# EasyEDA Pro project ProPrj_WatcheRobot2.0openSource_2026-06-17.epro, schematic 无线充电底座PCB
Assembly Variant: Basic; Board Name: Board1; Create Date: 2026-04-29; Page Name: P1; Project Name: WatcheRobot2.0; Schematic Name: Schematic4; Update Date: 2026-04-29; Company: 嘉立创EDA; Page Size: A4; Version: V1.0
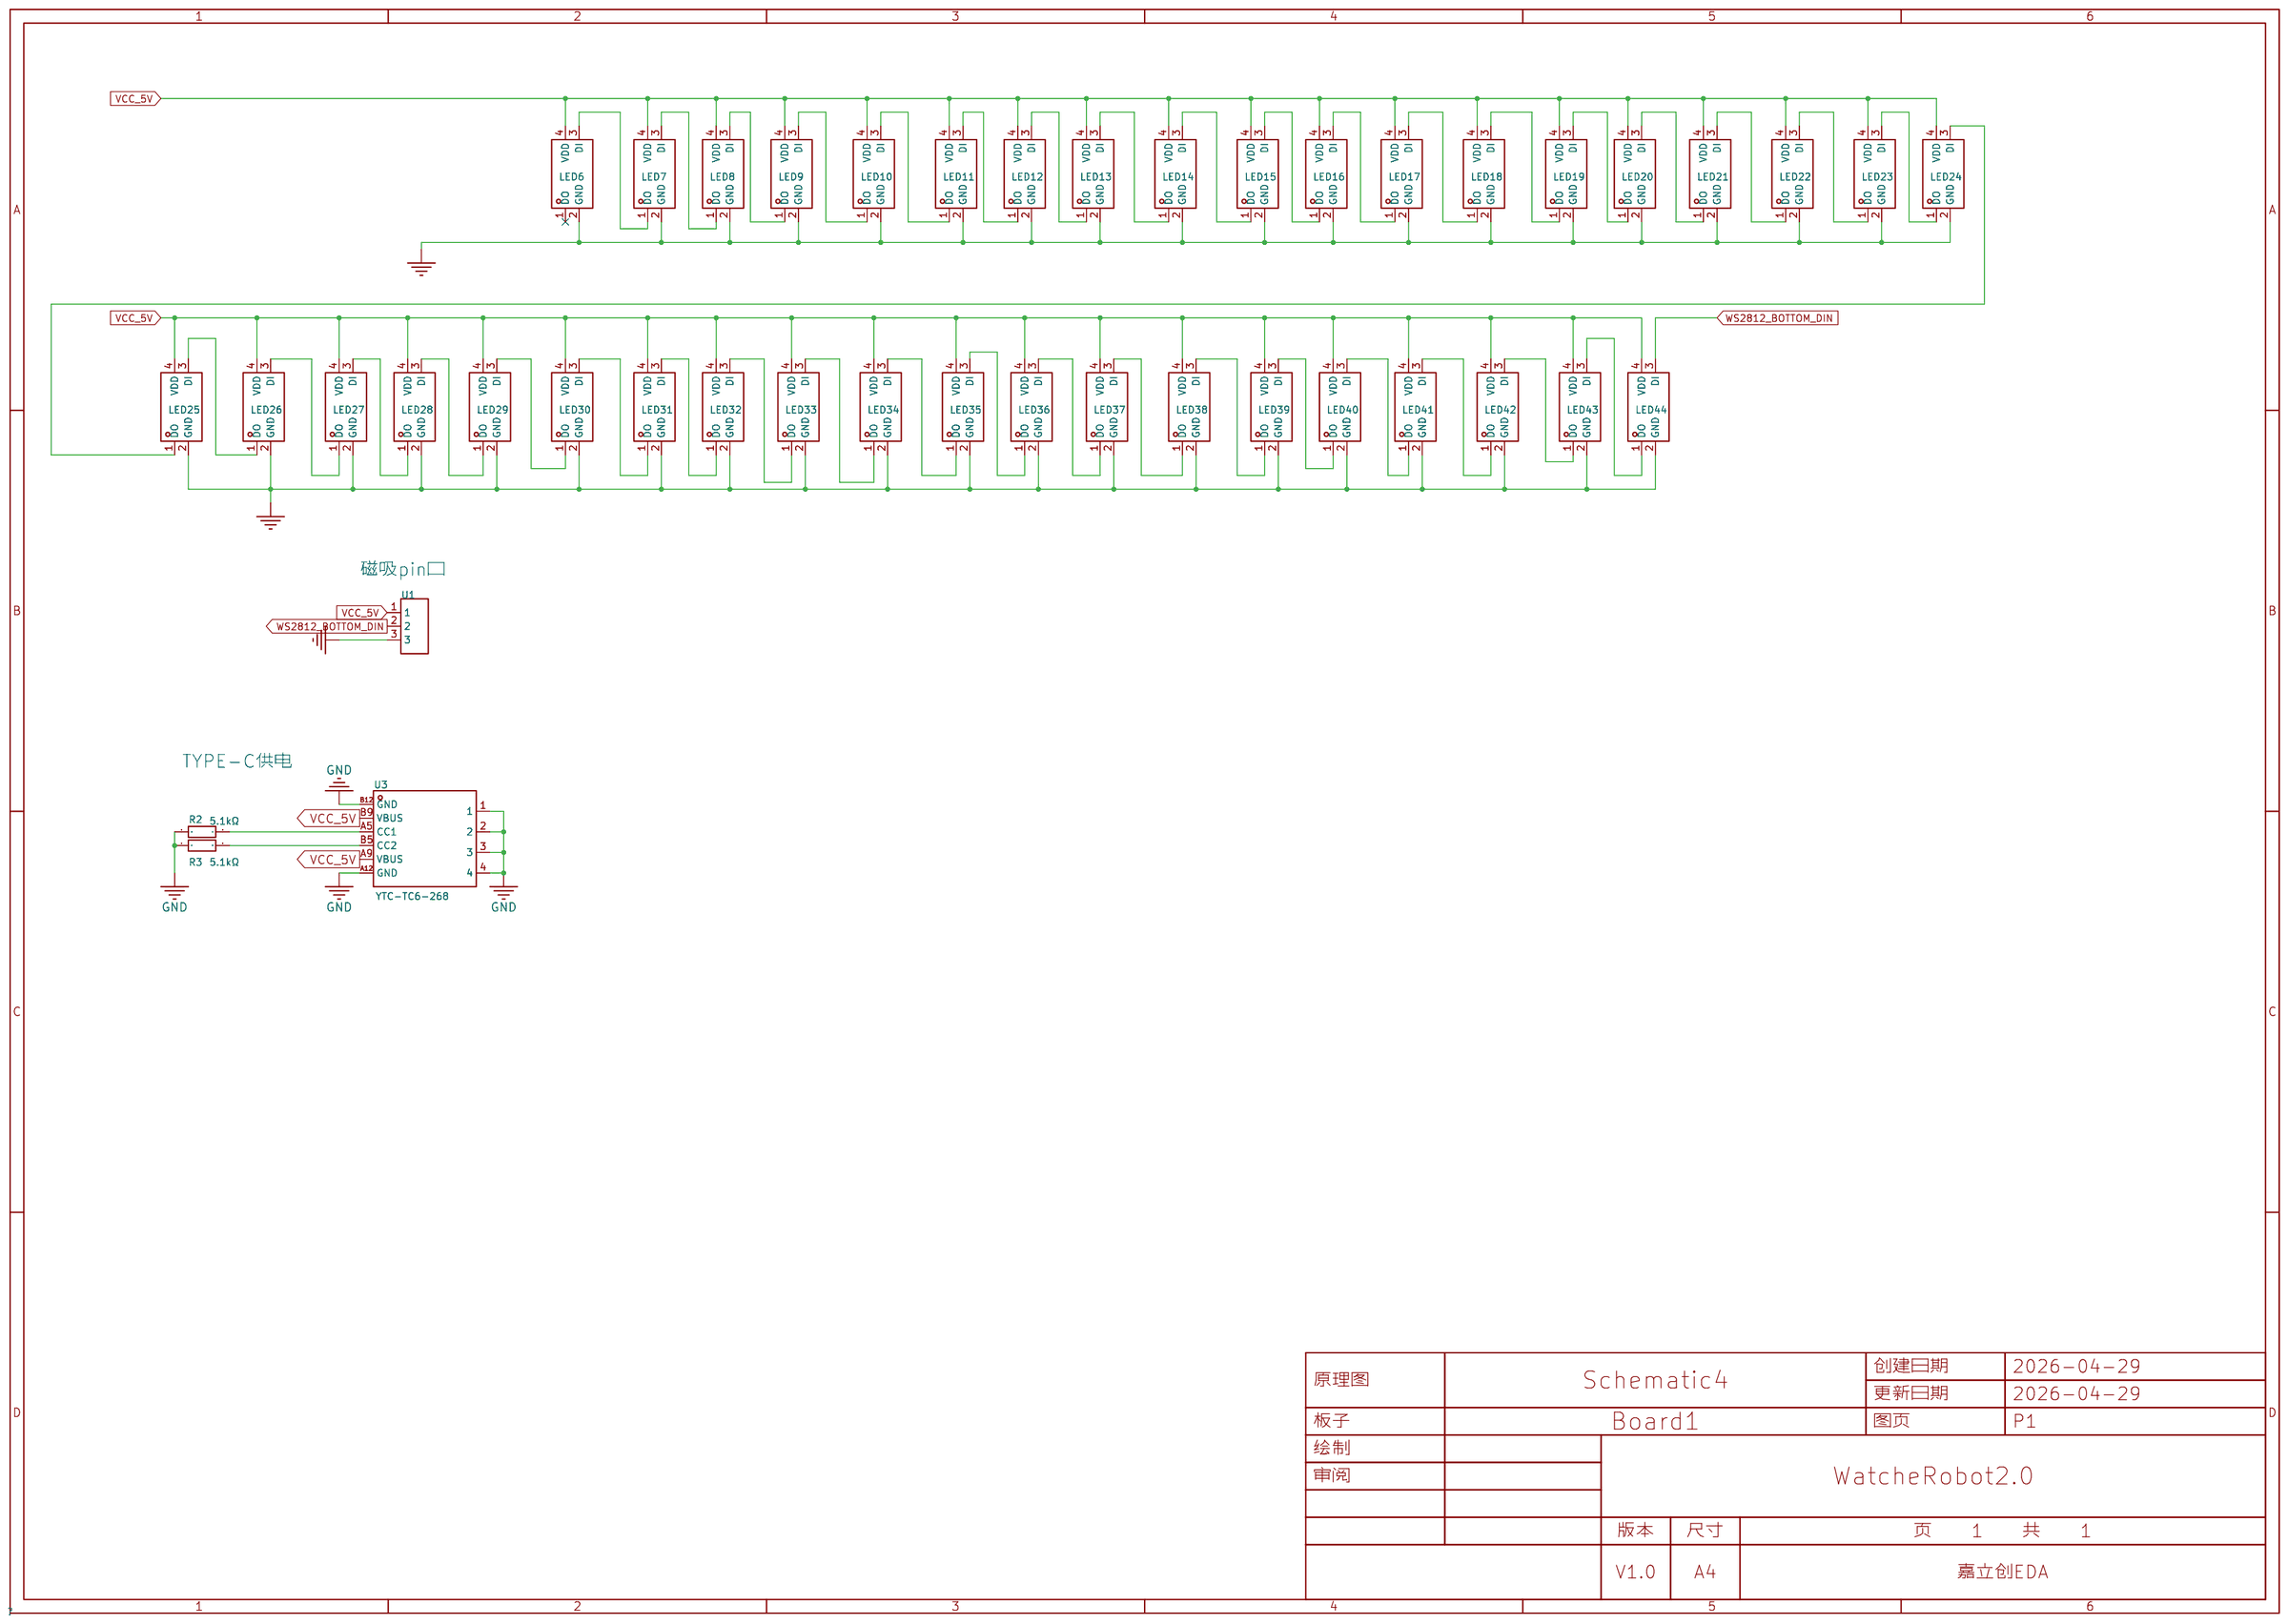
[diagram p1: schematic sheet]

## Parts
LED6  WS2812B-2020  [LED-SMD_4P-L2.0-W2.0-TL_WS2812B-2020]
LED7  WS2812B-2020  [LED-SMD_4P-L2.0-W2.0-TL_WS2812B-2020]
LED8  WS2812B-2020  [LED-SMD_4P-L2.0-W2.0-TL_WS2812B-2020]
LED9  WS2812B-2020  [LED-SMD_4P-L2.0-W2.0-TL_WS2812B-2020]
LED10  WS2812B-2020  [LED-SMD_4P-L2.0-W2.0-TL_WS2812B-2020]
LED11  WS2812B-2020  [LED-SMD_4P-L2.0-W2.0-TL_WS2812B-2020]
LED12  WS2812B-2020  [LED-SMD_4P-L2.0-W2.0-TL_WS2812B-2020]
LED13  WS2812B-2020  [LED-SMD_4P-L2.0-W2.0-TL_WS2812B-2020]
LED14  WS2812B-2020  [LED-SMD_4P-L2.0-W2.0-TL_WS2812B-2020]
LED15  WS2812B-2020  [LED-SMD_4P-L2.0-W2.0-TL_WS2812B-2020]
LED16  WS2812B-2020  [LED-SMD_4P-L2.0-W2.0-TL_WS2812B-2020]
LED17  WS2812B-2020  [LED-SMD_4P-L2.0-W2.0-TL_WS2812B-2020]
LED18  WS2812B-2020  [LED-SMD_4P-L2.0-W2.0-TL_WS2812B-2020]
LED19  WS2812B-2020  [LED-SMD_4P-L2.0-W2.0-TL_WS2812B-2020]
LED20  WS2812B-2020  [LED-SMD_4P-L2.0-W2.0-TL_WS2812B-2020]
LED21  WS2812B-2020  [LED-SMD_4P-L2.0-W2.0-TL_WS2812B-2020]
LED22  WS2812B-2020  [LED-SMD_4P-L2.0-W2.0-TL_WS2812B-2020]
LED23  WS2812B-2020  [LED-SMD_4P-L2.0-W2.0-TL_WS2812B-2020]
LED24  WS2812B-2020  [LED-SMD_4P-L2.0-W2.0-TL_WS2812B-2020]
LED25  WS2812B-2020  [LED-SMD_4P-L2.0-W2.0-TL_WS2812B-2020]
LED26  WS2812B-2020  [LED-SMD_4P-L2.0-W2.0-TL_WS2812B-2020]
LED27  WS2812B-2020  [LED-SMD_4P-L2.0-W2.0-TL_WS2812B-2020]
LED28  WS2812B-2020  [LED-SMD_4P-L2.0-W2.0-TL_WS2812B-2020]
LED29  WS2812B-2020  [LED-SMD_4P-L2.0-W2.0-TL_WS2812B-2020]
LED30  WS2812B-2020  [LED-SMD_4P-L2.0-W2.0-TL_WS2812B-2020]
LED31  WS2812B-2020  [LED-SMD_4P-L2.0-W2.0-TL_WS2812B-2020]
LED32  WS2812B-2020  [LED-SMD_4P-L2.0-W2.0-TL_WS2812B-2020]
LED33  WS2812B-2020  [LED-SMD_4P-L2.0-W2.0-TL_WS2812B-2020]
LED34  WS2812B-2020  [LED-SMD_4P-L2.0-W2.0-TL_WS2812B-2020]
LED35  WS2812B-2020  [LED-SMD_4P-L2.0-W2.0-TL_WS2812B-2020]
LED36  WS2812B-2020  [LED-SMD_4P-L2.0-W2.0-TL_WS2812B-2020]
LED37  WS2812B-2020  [LED-SMD_4P-L2.0-W2.0-TL_WS2812B-2020]
LED38  WS2812B-2020  [LED-SMD_4P-L2.0-W2.0-TL_WS2812B-2020]
LED39  WS2812B-2020  [LED-SMD_4P-L2.0-W2.0-TL_WS2812B-2020]
LED40  WS2812B-2020  [LED-SMD_4P-L2.0-W2.0-TL_WS2812B-2020]
LED41  WS2812B-2020  [LED-SMD_4P-L2.0-W2.0-TL_WS2812B-2020]
LED42  WS2812B-2020  [LED-SMD_4P-L2.0-W2.0-TL_WS2812B-2020]
LED43  WS2812B-2020  [LED-SMD_4P-L2.0-W2.0-TL_WS2812B-2020]
LED44  WS2812B-2020  [LED-SMD_4P-L2.0-W2.0-TL_WS2812B-2020]
R2  5.1kΩ  [R0603_3]
R3  5.1kΩ  [R0603_3]
U1  PR5L5015-3P-C-H  [CONN-TH_PR5L5015-3P-C-H]
U3  YTC-TC6-268  [TYPE-C-SMD_YIYUAN_YTC-TC6-268]

## Library data of the parts
LED6-LED44 = WS2812B-2020: 12mA，小尺寸，高亮，用于小间距，小尺寸产品（注意防潮，请查阅规格书中对应具体内容）; LCSC Part Name: RGB三色; Supplier Part: C965555; Manufacturer: worldsemi; Supplier Footprint: SMD,2.2x2mm; JLCPCB Part Class: 扩展库; Datasheet: https://item.szlcsc.com/datasheet/WS2812B-2020/1051115.html; Supplier: LCSC; Wavelength: 515.6nm；622.5nm；470.4nm; Luminous Intensity: 200mcd；160mcd；520mcd; Data Transmission Rate: 100KB/S; Voltage - Supply: 5V; Installation method: 正贴
R2 R3 = 0603WAF5101T5E: 电阻类型:厚膜电阻;阻值:5.1kΩ;精度:±1%;功率:100mW;温度系数:±100ppm/;最大工作电压:75V;工作温度范围:-55~+155;; LCSC Part Name: 5.1kΩ ±1% 100mW; Supplier Part: C23186; Manufacturer: UNI-ROYAL(厚声); Supplier Footprint: 0603; JLCPCB Part Class: 基础库; Datasheet: https://atta.szlcsc.com/upload/public/pdf/source/20200306/C422600_1E6D84923E4A46A82E41ADD87F860B5C.pdf; Supplier: LCSC; Type: 厚膜电阻; Tolerance: ±1%; Power(Watts): 100mW; Temperature Coefficient: ±100ppm/; Overload Voltage (Max): 75V; Operating Temperature Range: -55~+155
U1 = PR5L5015-3P-C-H: 类型:弹簧顶针(POGO PIN);总PIN数:3P;间距:2.54mm;全长/全高:-;工作高度:-;接触电阻:-;弹性寿命:10000次;额定电流:2A;额定电压:12V;触头材质:黄铜;触头镀层:金;工作温度:-40℃~+85℃;; LCSC Part Name: 2.54-3P磁吸弹簧探针连接器公头POGOPIN适配PR5L4015-3P-C-F; Supplier Part: C41361291; Manufacturer: SAMZO(三佐); JLCPCB Part Class: Extended Part; Datasheet: https://item.szlcsc.com/datasheet/PR5L5015-3P-C-H/43105442.html; Supplier: LCSC; Type: 弹簧顶针(POGO PIN); Number of Pins: 3P; Pitch: 2.54mm; Elastic Life: 10000次; Current Rating: 2A; Voltage Rating: 12V; Contact Material: 黄铜; Contact Plating: 金; Operating Temperature: -40℃~+85℃
U3 = YTC-TC6-268: 连接器类型:Type-C;公母:母座;触点数量:6;; LCSC Part Name: Type-C 母座; Supplier Part: C5260484; Manufacturer: YIYUAN(怡远); Supplier Footprint: SMD; JLCPCB Part Class: 扩展库; Datasheet: https://atta.szlcsc.com/upload/public/pdf/source/20221115/94102468E8C367463F1D717839C68408.pdf; Supplier: LCSC; Connector Type: Type-C; Gender: 母座; Number of Contacts: 6

## Nets
GND: LED6.2(GND) LED7.2(GND) LED8.2(GND) LED9.2(GND) LED10.2(GND) LED11.2(GND) LED12.2(GND) LED13.2(GND) LED14.2(GND) LED15.2(GND) LED16.2(GND) LED17.2(GND) LED18.2(GND) LED19.2(GND) LED20.2(GND) LED21.2(GND) LED22.2(GND) LED23.2(GND) LED24.2(GND) LED25.2(GND) LED26.2(GND) LED27.2(GND) LED28.2(GND) LED29.2(GND) LED30.2(GND) LED31.2(GND) LED32.2(GND) LED33.2(GND) LED34.2(GND) LED35.2(GND) LED36.2(GND) LED37.2(GND) LED38.2(GND) LED39.2(GND) LED40.2(GND) LED41.2(GND) LED42.2(GND) LED43.2(GND) LED44.2(GND) R2.1 R3.1 U1.3 U3.1 U3.2 U3.3 U3.4 U3.A12(GND) U3.B12(GND)
VCC_5V: LED6.4(VDD) LED7.4(VDD) LED8.4(VDD) LED9.4(VDD) LED10.4(VDD) LED11.4(VDD) LED12.4(VDD) LED13.4(VDD) LED14.4(VDD) LED15.4(VDD) LED16.4(VDD) LED17.4(VDD) LED18.4(VDD) LED19.4(VDD) LED20.4(VDD) LED21.4(VDD) LED22.4(VDD) LED23.4(VDD) LED24.4(VDD) LED25.4(VDD) LED26.4(VDD) LED27.4(VDD) LED28.4(VDD) LED29.4(VDD) LED30.4(VDD) LED31.4(VDD) LED32.4(VDD) LED33.4(VDD) LED34.4(VDD) LED35.4(VDD) LED36.4(VDD) LED37.4(VDD) LED38.4(VDD) LED39.4(VDD) LED40.4(VDD) LED41.4(VDD) LED42.4(VDD) LED43.4(VDD) LED44.4(VDD) U1.1 U3.A9(VBUS) U3.B9(VBUS)
WS2812_BOTTOM_DIN: LED44.3(DI) U1.2
$1N33: R3.2 U3.B5(CC2)
$1N34: R2.2 U3.A5(CC1)
$1N50: LED43.3(DI) LED44.1(DO)
$1N53: LED6.3(DI) LED7.1(DO)
$1N54: LED7.3(DI) LED8.1(DO)
$1N55: LED8.3(DI) LED9.1(DO)
$1N56: LED9.3(DI) LED10.1(DO)
$1N57: LED10.3(DI) LED11.1(DO)
$1N58: LED11.3(DI) LED12.1(DO)
$1N59: LED12.3(DI) LED13.1(DO)
$1N60: LED13.3(DI) LED14.1(DO)
$1N61: LED14.3(DI) LED15.1(DO)
$1N62: LED15.3(DI) LED16.1(DO)
$1N63: LED16.3(DI) LED17.1(DO)
$1N64: LED17.3(DI) LED18.1(DO)
$1N65: LED18.3(DI) LED19.1(DO)
$1N66: LED19.3(DI) LED20.1(DO)
$1N67: LED20.3(DI) LED21.1(DO)
$1N68: LED21.3(DI) LED22.1(DO)
$1N69: LED22.3(DI) LED23.1(DO)
$1N70: LED23.3(DI) LED24.1(DO)
$1N73: LED24.3(DI) LED25.1(DO)
$1N74: LED25.3(DI) LED26.1(DO)
$1N75: LED42.3(DI) LED43.1(DO)
$1N76: LED41.3(DI) LED42.1(DO)
$1N77: LED40.3(DI) LED41.1(DO)
$1N78: LED39.3(DI) LED40.1(DO)
$1N79: LED38.3(DI) LED39.1(DO)
$1N80: LED37.3(DI) LED38.1(DO)
$1N81: LED36.3(DI) LED37.1(DO)
$1N82: LED35.3(DI) LED36.1(DO)
$1N83: LED34.3(DI) LED35.1(DO)
$1N84: LED33.3(DI) LED34.1(DO)
$1N85: LED32.3(DI) LED33.1(DO)
$1N86: LED31.3(DI) LED32.1(DO)
$1N87: LED30.3(DI) LED31.1(DO)
$1N88: LED29.3(DI) LED30.1(DO)
$1N89: LED28.3(DI) LED29.1(DO)
$1N90: LED27.3(DI) LED28.1(DO)
$1N91: LED26.3(DI) LED27.1(DO)

Not connected (* = marked no-connect by the designer): LED6 1(DO)*

## Notes on the sheet
- 磁吸pin口
- TYPE-C供电
